# EAGLE schematic ATEMconsole (EAGLE 6.2)
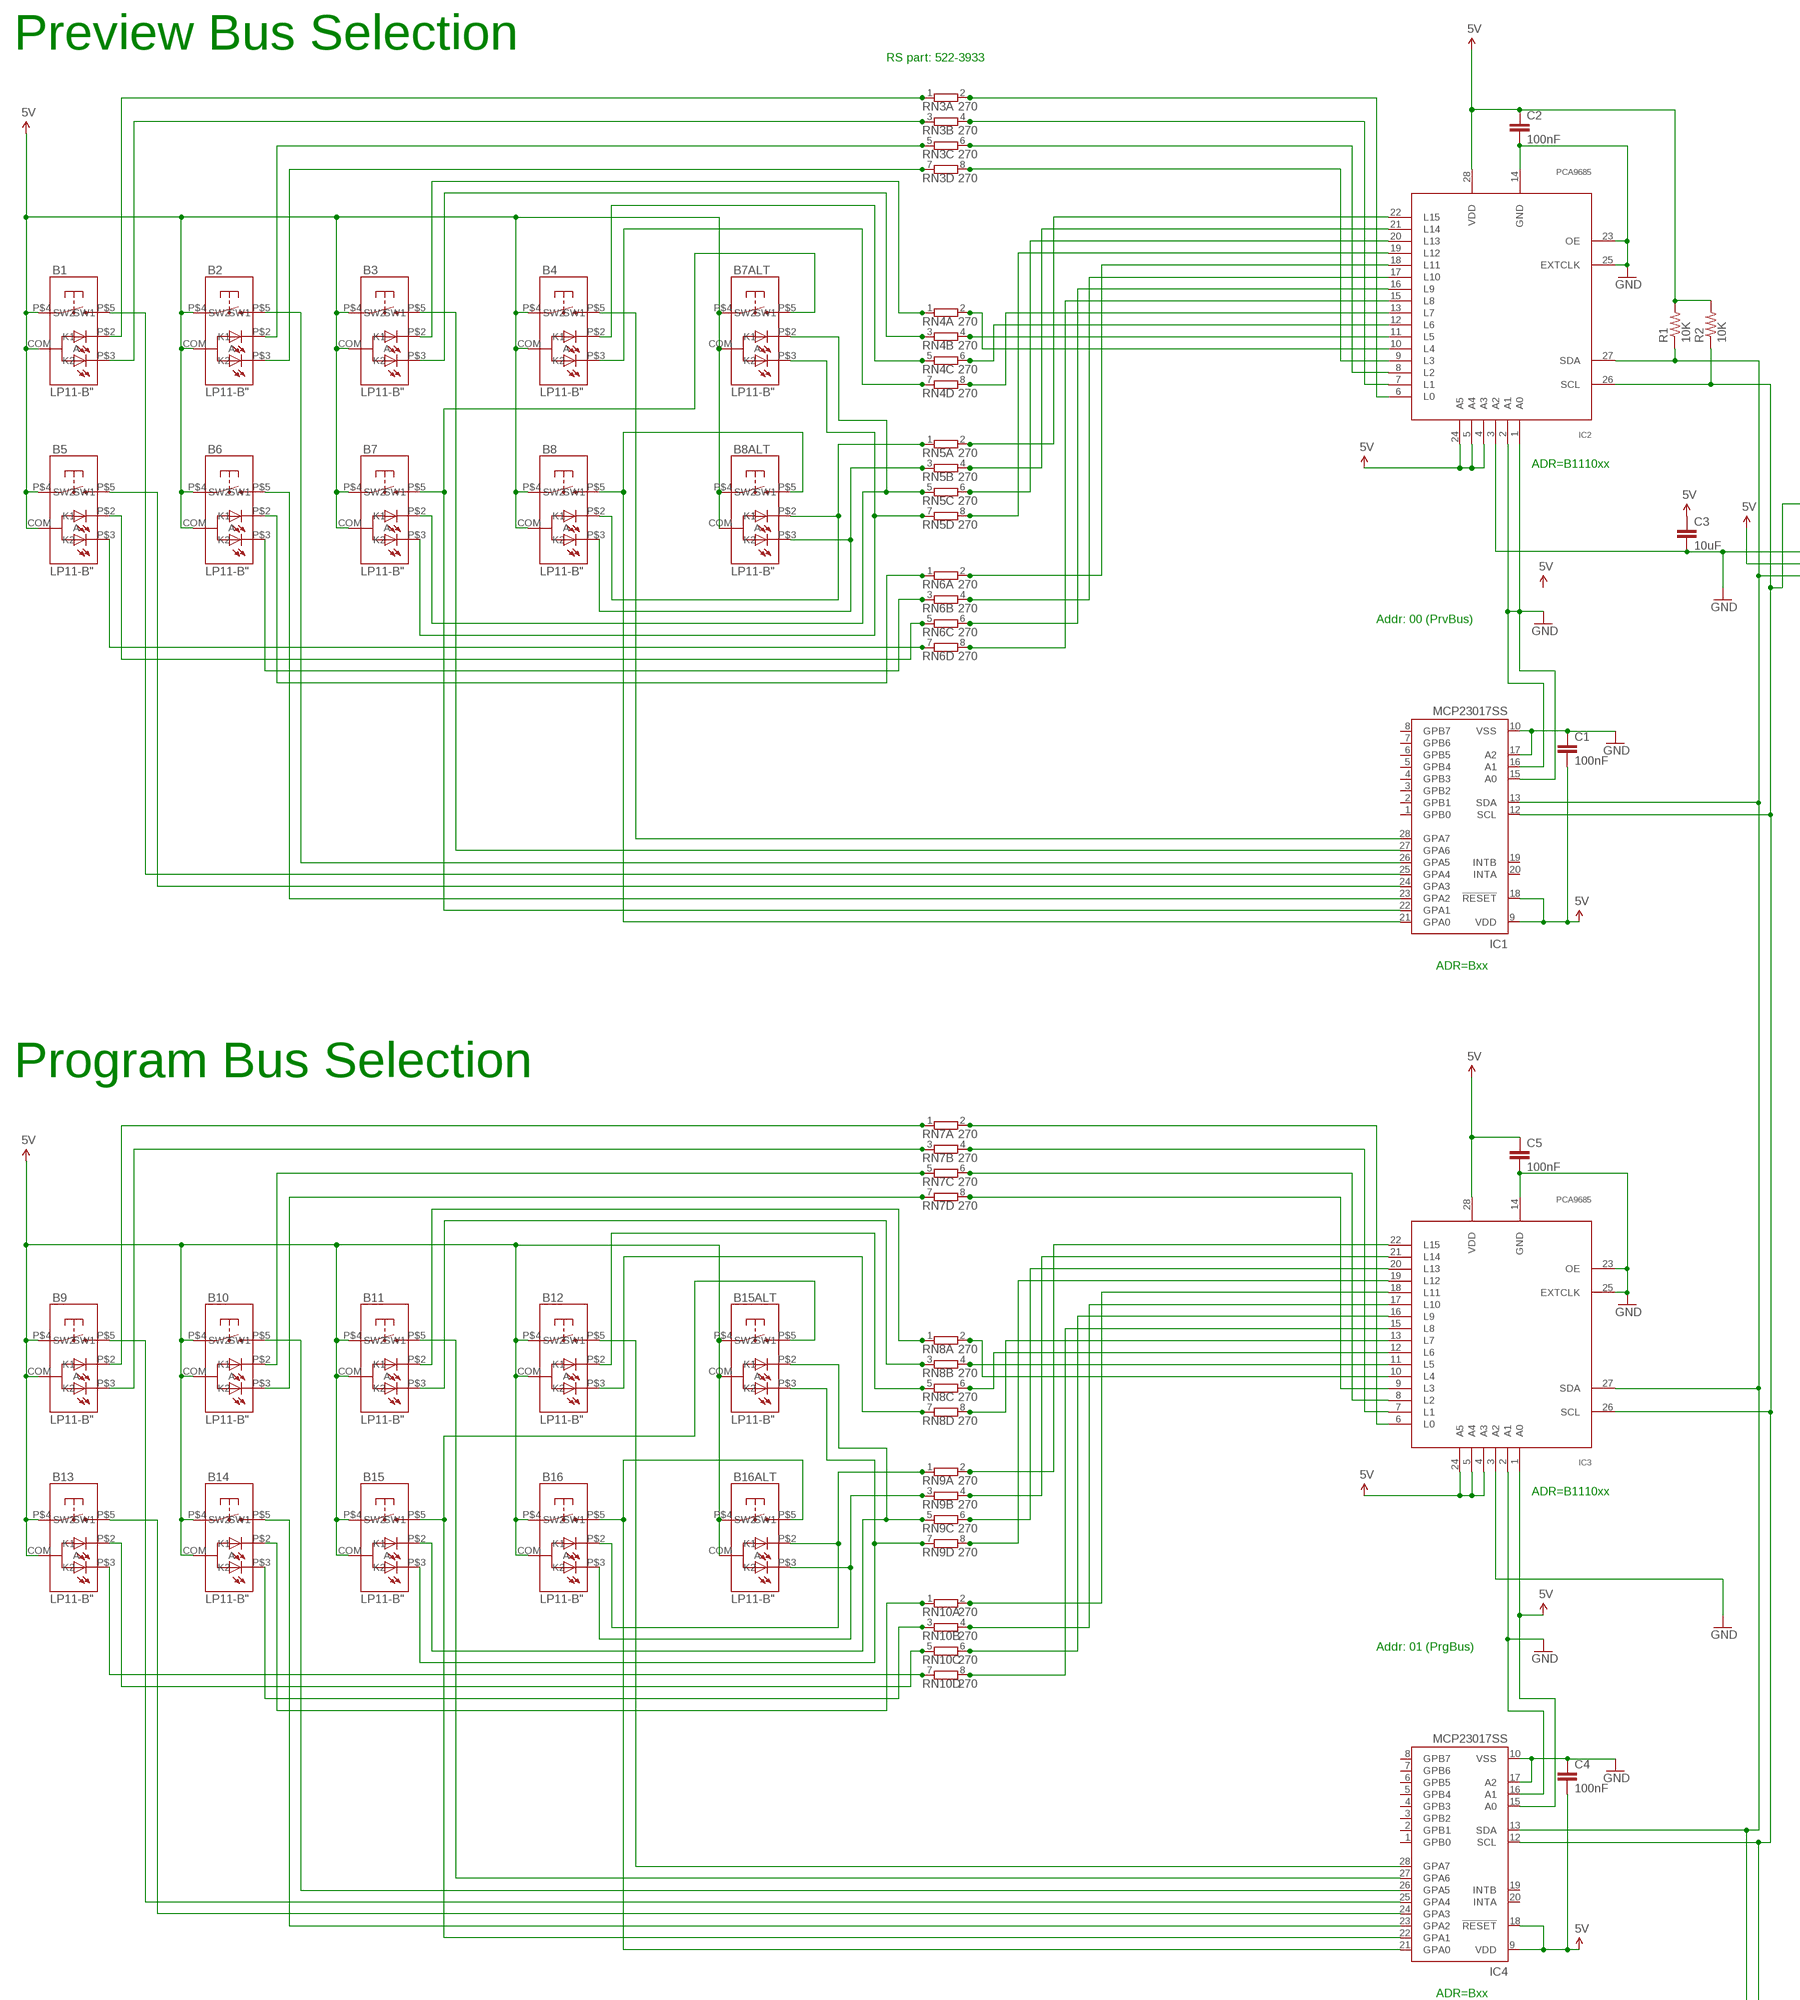
[diagram p0: schematic, sheet 1, part 1 of 3]
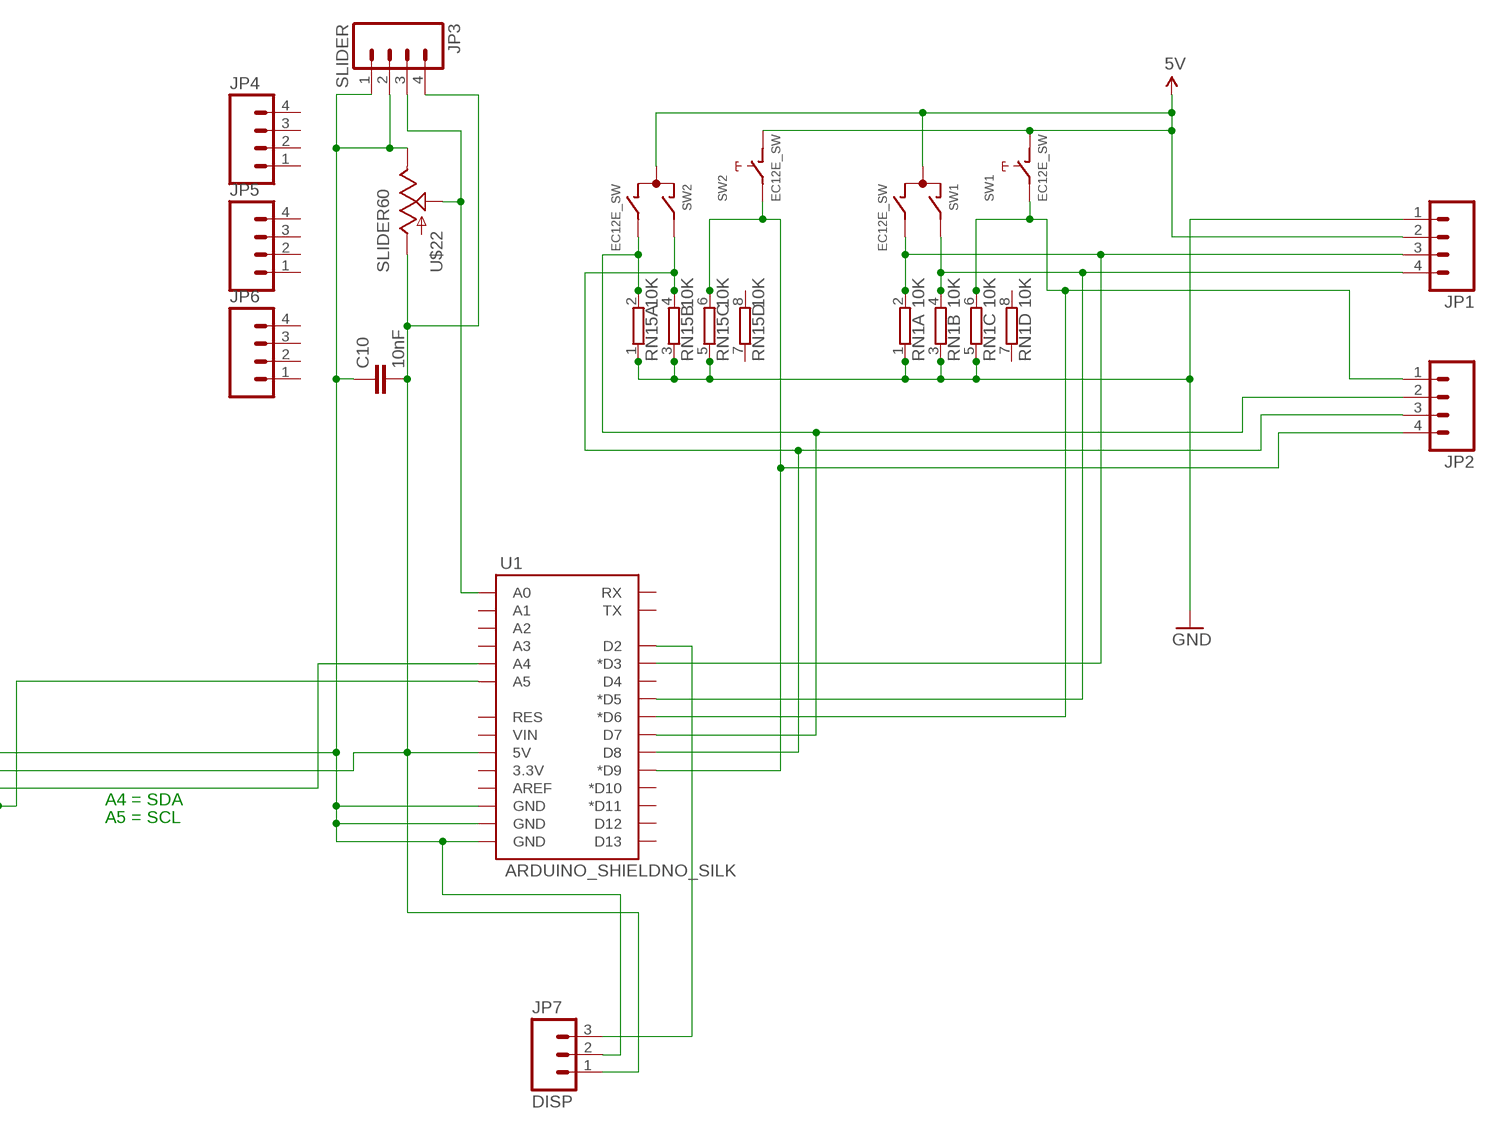
[diagram p1: schematic, sheet 1, part 2 of 3]
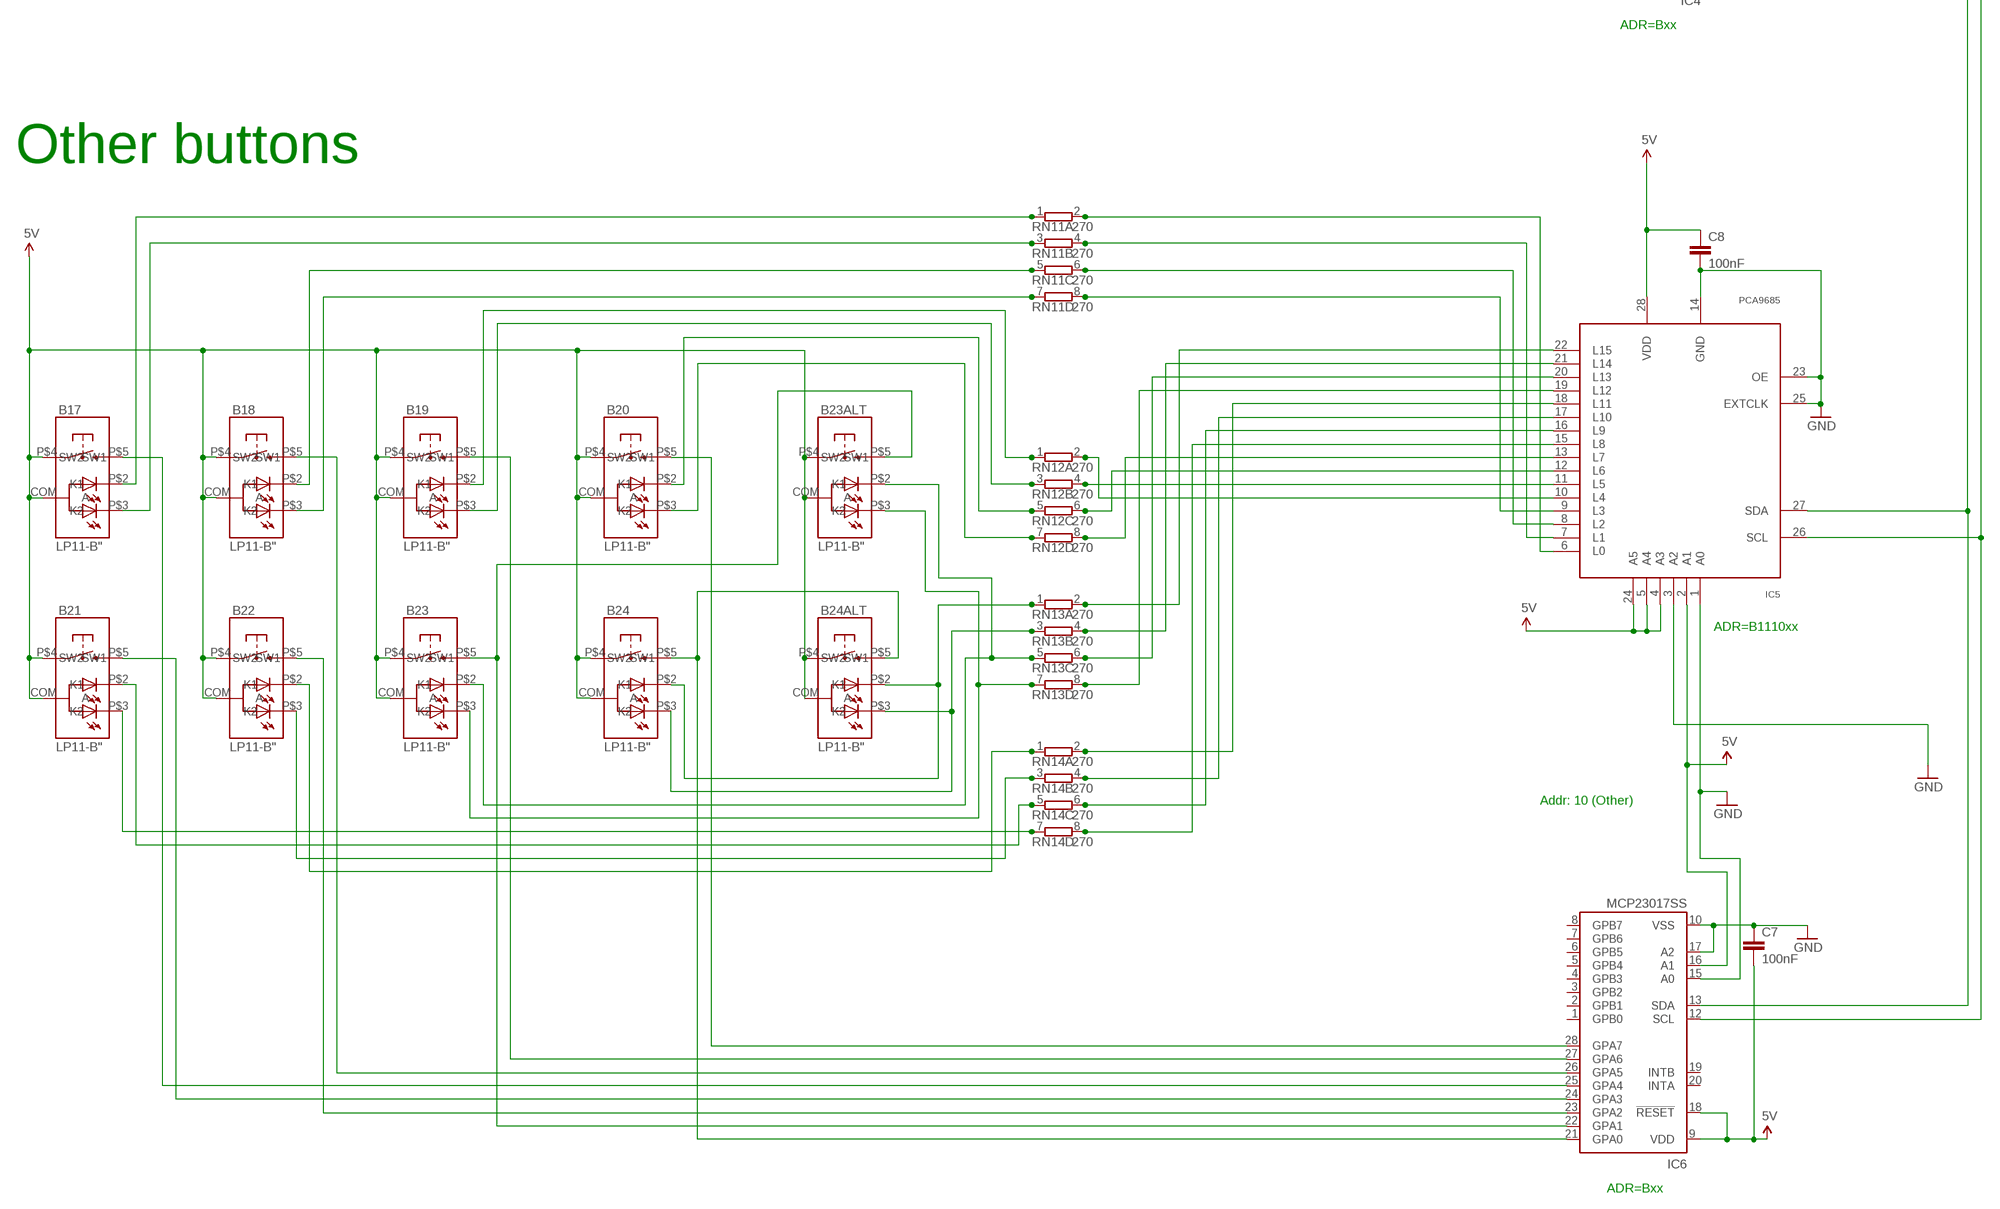
[diagram p2: schematic, sheet 1, part 3 of 3]

## Parts
B1  LP11-B"  [LP11]
B2  LP11-B"  [LP11]
B3  LP11-B"  [LP11]
B4  LP11-B"  [LP11]
B5  LP11-B"  [LP11]
B6  LP11-B"  [LP11]
B7  LP11-B"  [LP11]
B7ALT  LP11-B"  [LP11]
B8  LP11-B"  [LP11]
B8ALT  LP11-B"  [LP11]
B9  LP11-B"  [LP11]
B10  LP11-B"  [LP11]
B11  LP11-B"  [LP11]
B12  LP11-B"  [LP11]
B13  LP11-B"  [LP11]
B14  LP11-B"  [LP11]
B15  LP11-B"  [LP11]
B15ALT  LP11-B"  [LP11]
B16  LP11-B"  [LP11]
B16ALT  LP11-B"  [LP11]
B17  LP11-B"  [LP11]
B18  LP11-B"  [LP11]
B19  LP11-B"  [LP11]
B20  LP11-B"  [LP11]
B21  LP11-B"  [LP11]
B22  LP11-B"  [LP11]
B23  LP11-B"  [LP11]
B23ALT  LP11-B"  [LP11]
B24  LP11-B"  [LP11]
B24ALT  LP11-B"  [LP11]
C1  100nF  CAP_  [AXIAL-5MM]
C2  100nF  CAP_  [AXIAL-5MM]
C3  10uF  CAP_  [AXIAL-5MM]
C4  100nF  CAP_  [AXIAL-5MM]
C5  100nF  CAP_  [AXIAL-5MM]
C7  100nF  CAP_  [AXIAL-5MM]
C8  100nF  CAP_  [AXIAL-5MM]
C10  10nF  CAP_  [AXIAL-5MM]
IC1  MCP23017SS  [SSOP28]
IC2  PCA9685  [TSSOP28]
IC3  PCA9685  [TSSOP28]
IC4  MCP23017SS  [SSOP28]
IC5  PCA9685  [TSSOP28]
IC6  MCP23017SS  [SSOP28]
JP1  M04PTH  [1X04]
JP2  M04PTH  [1X04]
JP3  SLIDER  M04PTH  [1X04]
JP4  M04PTH  [1X04]
JP5  M04PTH  [1X04]
JP6  M04PTH  [1X04]
JP7  DISP  M03PTH  [1X03]
R1  10K  RESISTOR0603-RES  [0603-RES]
R2  10K  RESISTOR0603-RES  [0603-RES]
RN1  10K  E4R  [SIL8]
RN3  270  E4R  [SIL8]
RN4  270  E4R  [SIL8]
RN5  270  E4R  [SIL8]
RN6  270  E4R  [SIL8]
RN7  270  E4R  [SIL8]
RN8  270  E4R  [SIL8]
RN9  270  E4R  [SIL8]
RN10  270  E4R  [SIL8]
RN11  270  E4R  [SIL8]
RN12  270  E4R  [SIL8]
RN13  270  E4R  [SIL8]
RN14  270  E4R  [SIL8]
RN15  10K  E4R  [SIL8]
SW1  EC12E_SW  [ALPS_EC12E_SW]
SW2  EC12E_SW  [ALPS_EC12E_SW]
U1  ARDUINO_SHIELDNO_SILK  [DUEMILANOVE_VIAS]
U$22  SLIDER60  [SLIDER60]

## Nets
5V [Power]: B1.COM(A) B1.P$4(SW1) B2.COM(A) B2.P$4(SW1) B3.COM(A) B3.P$4(SW1) B4.COM(A) B4.P$4(SW1) B5.COM(A) B5.P$4(SW1) B6.COM(A) B6.P$4(SW1) B7.COM(A) B7.P$4(SW1) B7ALT.COM(A) B7ALT.P$4(SW1) B8.COM(A) B8.P$4(SW1) B8ALT.COM(A) B8ALT.P$4(SW1) B9.COM(A) B9.P$4(SW1) B10.COM(A) B10.P$4(SW1) B11.COM(A) B11.P$4(SW1) B12.COM(A) B12.P$4(SW1) B13.COM(A) B13.P$4(SW1) B14.COM(A) B14.P$4(SW1) B15.COM(A) B15.P$4(SW1) B15ALT.COM(A) B15ALT.P$4(SW1) B16.COM(A) B16.P$4(SW1) B16ALT.COM(A) B16ALT.P$4(SW1) B17.COM(A) B17.P$4(SW1) B18.COM(A) B18.P$4(SW1) B19.COM(A) B19.P$4(SW1) B20.COM(A) B20.P$4(SW1) B21.COM(A) B21.P$4(SW1) B22.COM(A) B22.P$4(SW1) B23.COM(A) B23.P$4(SW1) B23ALT.COM(A) B23ALT.P$4(SW1) B24.COM(A) B24.P$4(SW1) B24ALT.COM(A) B24ALT.P$4(SW1) C1.P$2 C2.P$1 C3.P$1 C4.P$2 C5.P$1 C7.P$2 C8.P$1 C10.P$2 IC1.9(VDD) IC1.18(!RESET) IC2.4(A3) IC2.5(A4) IC2.24(A5) IC2.28(VDD) IC3.1(A0) IC3.4(A3) IC3.5(A4) IC3.24(A5) IC3.28(VDD) IC4.9(VDD) IC4.15(A0) IC4.18(!RESET) IC5.2(A1) IC5.4(A3) IC5.5(A4) IC5.24(A5) IC5.28(VDD) IC6.9(VDD) IC6.16(A1) IC6.18(!RESET) JP1.2 JP3.4 JP7.1 R1.2 R2.2 SW1.C SW1.D SW2.C SW2.D U1.5V U$22.3(A)
GND [Power]: C1.P$1 C2.P$2 C3.P$2 C4.P$1 C5.P$2 C7.P$1 C8.P$2 C10.P$1 IC1.10(VSS) IC1.15(A0) IC1.16(A1) IC1.17(A2) IC2.1(A0) IC2.2(A1) IC2.3(A2) IC2.14(GND) IC2.23(OE) IC2.25(EXTCLK) IC3.2(A1) IC3.3(A2) IC3.14(GND) IC3.23(OE) IC3.25(EXTCLK) IC4.10(VSS) IC4.16(A1) IC4.17(A2) IC5.1(A0) IC5.3(A2) IC5.14(GND) IC5.23(OE) IC5.25(EXTCLK) IC6.10(VSS) IC6.15(A0) IC6.17(A2) JP1.1 JP3.1 JP3.2 JP7.2 RN1.1 RN1.3 RN1.5 RN15.1 RN15.3 RN15.5 U1.GND@0(GND) U1.GND@1(GND) U1.GND@2(GND) U$22.1(E)
JP1: JP2.2 RN15.2 SW2.B U1.D7
N$1: JP7.3 U1.D2
N$2: B7.P$3(K2) B7ALT.P$3(K2) RN5.7
N$4: B2.P$2(K1) RN3.5
N$5: B2.P$3(K2) RN3.7
N$7: B1.P$2(K1) RN3.1
N$8: B1.P$3(K2) RN3.3
N$9: IC2.6(L0) RN3.2
N$10: IC2.7(L1) RN3.4
N$11: IC2.8(L2) RN3.6
N$12: IC2.9(L3) RN3.8
N$13: IC2.10(L4) RN4.2
N$14: IC2.11(L5) RN4.4
N$15: IC2.12(L6) RN4.6
N$16: IC2.13(L7) RN4.8
N$17: B3.P$2(K1) RN4.1
N$18: B3.P$3(K2) RN4.3
N$19: B4.P$2(K1) RN4.5
N$20: B4.P$3(K2) RN4.7
N$21: IC2.19(L12) RN5.8
N$22: IC2.20(L13) RN5.6
N$23: IC2.21(L14) RN5.4
N$24: IC2.22(L15) RN5.2
N$25: IC2.15(L8) RN6.8
N$26: IC2.16(L9) RN6.6
N$27: IC2.17(L10) RN6.4
N$28: IC2.18(L11) RN6.2
N$29: B5.P$3(K2) RN6.7
N$30: B5.P$2(K1) RN6.5
N$31: B6.P$3(K2) RN6.3
N$32: B6.P$2(K1) RN6.1
N$34: B9.P$2(K1) RN7.1
N$35: B8.P$3(K2) B8ALT.P$3(K2) RN5.3
N$36: B8.P$2(K1) B8ALT.P$2(K1) RN5.1
N$37: B1.P$5(SW2) IC1.25(GPA4)
N$38: B5.P$5(SW2) IC1.24(GPA3)
N$39: B6.P$5(SW2) IC1.23(GPA2)
N$40: B2.P$5(SW2) IC1.26(GPA5)
N$41: B8.P$5(SW2) B8ALT.P$5(SW2) IC1.21(GPA0)
N$42: B7.P$5(SW2) B7ALT.P$5(SW2) IC1.22(GPA1)
N$43: B4.P$5(SW2) IC1.28(GPA7)
N$44: B3.P$5(SW2) IC1.27(GPA6)
N$45: B9.P$3(K2) RN7.3
N$46: B7.P$2(K1) B7ALT.P$2(K1) RN5.5
N$47: B10.P$2(K1) RN7.5
N$48: B10.P$3(K2) RN7.7
N$49: IC3.6(L0) RN7.2
N$50: IC3.7(L1) RN7.4
N$51: IC3.8(L2) RN7.6
N$52: IC3.9(L3) RN7.8
N$53: IC3.10(L4) RN8.2
N$54: IC3.11(L5) RN8.4
N$55: IC3.12(L6) RN8.6
N$56: IC3.13(L7) RN8.8
N$57: B11.P$2(K1) RN8.1
N$58: B11.P$3(K2) RN8.3
N$59: B12.P$2(K1) RN8.5
N$60: B12.P$3(K2) RN8.7
N$61: IC3.19(L12) RN9.8
N$62: IC3.20(L13) RN9.6
N$63: IC3.21(L14) RN9.4
N$64: IC3.22(L15) RN9.2
N$65: IC3.15(L8) RN10.8
N$66: IC3.16(L9) RN10.6
N$67: IC3.17(L10) RN10.4
N$68: IC3.18(L11) RN10.2
N$69: B13.P$3(K2) RN10.7
N$70: B13.P$2(K1) RN10.5
N$71: B14.P$3(K2) RN10.3
N$72: B14.P$2(K1) RN10.1
N$73: B16.P$3(K2) B16ALT.P$3(K2) RN9.3
N$74: B16.P$2(K1) B16ALT.P$2(K1) RN9.1
N$75: B9.P$5(SW2) IC4.25(GPA4)
N$76: B13.P$5(SW2) IC4.24(GPA3)
N$77: B14.P$5(SW2) IC4.23(GPA2)
N$78: B10.P$5(SW2) IC4.26(GPA5)
N$79: B16.P$5(SW2) B16ALT.P$5(SW2) IC4.21(GPA0)
N$80: B15.P$5(SW2) B15ALT.P$5(SW2) IC4.22(GPA1)
N$81: B12.P$5(SW2) IC4.28(GPA7)
N$82: B11.P$5(SW2) IC4.27(GPA6)
N$83: B15.P$2(K1) B15ALT.P$2(K1) RN9.5
N$84: B15.P$3(K2) B15ALT.P$3(K2) RN9.7
N$85: IC1.12(SCL) IC2.26(SCL) IC3.26(SCL) IC4.12(SCL) IC5.26(SCL) IC6.12(SCL) R2.1 U1.A5
N$86: IC1.13(SDA) IC2.27(SDA) IC3.27(SDA) IC4.13(SDA) IC5.27(SDA) IC6.13(SDA) R1.1 U1.A4
N$87: B17.P$2(K1) RN11.1
N$88: B17.P$3(K2) RN11.3
N$89: B18.P$2(K1) RN11.5
N$90: B18.P$3(K2) RN11.7
N$91: IC5.6(L0) RN11.2
N$92: IC5.7(L1) RN11.4
N$93: IC5.8(L2) RN11.6
N$94: IC5.9(L3) RN11.8
N$95: IC5.10(L4) RN12.2
N$96: IC5.11(L5) RN12.4
N$97: IC5.12(L6) RN12.6
N$98: IC5.13(L7) RN12.8
N$99: B19.P$2(K1) RN12.1
N$100: B19.P$3(K2) RN12.3
N$101: B20.P$2(K1) RN12.5
N$102: B20.P$3(K2) RN12.7
N$103: IC5.19(L12) RN13.8
N$104: IC5.20(L13) RN13.6
N$105: IC5.21(L14) RN13.4
N$106: IC5.22(L15) RN13.2
N$107: IC5.15(L8) RN14.8
N$108: IC5.16(L9) RN14.6
N$109: IC5.17(L10) RN14.4
N$110: IC5.18(L11) RN14.2
N$111: B21.P$3(K2) RN14.7
N$112: B21.P$2(K1) RN14.5
N$113: B22.P$3(K2) RN14.3
N$114: B22.P$2(K1) RN14.1
N$115: B24.P$3(K2) B24ALT.P$3(K2) RN13.3
N$116: B24.P$2(K1) B24ALT.P$2(K1) RN13.1
N$117: B17.P$5(SW2) IC6.25(GPA4)
N$118: B21.P$5(SW2) IC6.24(GPA3)
N$119: B22.P$5(SW2) IC6.23(GPA2)
N$120: B18.P$5(SW2) IC6.26(GPA5)
N$121: B24.P$5(SW2) B24ALT.P$5(SW2) IC6.21(GPA0)
N$122: B23.P$5(SW2) B23ALT.P$5(SW2) IC6.22(GPA1)
N$123: B20.P$5(SW2) IC6.28(GPA7)
N$124: B19.P$5(SW2) IC6.27(GPA6)
N$125: B23.P$2(K1) B23ALT.P$2(K1) RN13.5
N$126: B23.P$3(K2) B23ALT.P$3(K2) RN13.7
N$127: JP1.3 RN1.2 SW1.B U1.D3(*D3)
N$128: JP1.4 RN1.4 SW1.A U1.D5(*D5)
N$129: JP2.1 RN1.6 SW1.E U1.D6(*D6)
N$130: JP2.3 RN15.4 SW2.A U1.D8
N$131: JP2.4 RN15.6 SW2.E U1.D9(*D9)
N$132: JP3.3 U1.A0 U$22.2A(S)
Unconnected: IC1.1(GPB0) IC1.2(GPB1) IC1.3(GPB2) IC1.4(GPB3) IC1.5(GPB4) IC1.6(GPB5) IC1.7(GPB6) IC1.8(GPB7) IC1.19(INTB) IC1.20(INTA) IC4.1(GPB0) IC4.2(GPB1) IC4.3(GPB2) IC4.4(GPB3) IC4.5(GPB4) IC4.6(GPB5) IC4.7(GPB6) IC4.8(GPB7) IC4.19(INTB) IC4.20(INTA) IC6.1(GPB0) IC6.2(GPB1) IC6.3(GPB2) IC6.4(GPB3) IC6.5(GPB4) IC6.6(GPB5) IC6.7(GPB6) IC6.8(GPB7) IC6.19(INTB) IC6.20(INTA) JP4.1 JP4.2 JP4.3 JP4.4 JP5.1 JP5.2 JP5.3 JP5.4 JP6.1 JP6.2 JP6.3 JP6.4 RN1.7 RN1.8 RN15.7 RN15.8 SW1.GND1(G) SW1.GND2(G) SW2.GND1(G) SW2.GND2(G) U1.3.3V U1.A1 U1.A2 U1.A3 U1.AREF U1.D4 U1.D10(*D10) U1.D11(*D11) U1.D12 U1.D13 U1.RES U1.RX U1.TX U1.VIN

## Notes on the sheet
- Preview Bus Selection
- RS part: 522-3933
- ADR=B1110xx
- A4 = SDA
- A5 = SCL
- Addr: 00 (PrvBus)
- ADR=Bxx
- Program Bus Selection
- ADR=B1110xx
- Addr: 01 (PrgBus)
- ADR=Bxx
- Other buttons
- ADR=B1110xx
- Addr: 10 (Other)
- ADR=Bxx

## Library data of the parts
B1-B7 B7ALT B8 B8ALT B9-B15 B15ALT B16 B16ALT B17-B23 B23ALT B24 B24ALT = SKAARHOJ:LP11-B
C1-C5 C7 C8 C10 = SparkFun:CAP: Capacitor Standard 0603 ceramic capacitor, and 0.1" leaded capacitor.
IC1 IC4 IC6 = microchip:MCP23017: http://ww1.microchip.com/downloads/en/DeviceDoc/21952a.pdf Source: http://ww1.microchip.com/downloads/en/DeviceDoc/21952a.pdf; MF: MICROCHIP; MPN: MCP23017-E/SS; OC_FARNELL: 1467674; OC_NEWARK: 31K2960
IC2 IC3 IC5 = wsmith:PCA9685
JP1-JP6 = SparkFun:M04: Header 4 Standard 4-pin 0.1" header. Use with straight break away headers (SKU : PRT-00116), right angle break away headers (PRT-00553), swiss pins (PRT-00743), machine pins (PRT-00117), and female headers (PRT-00115). Molex polarized connector foot print use with SKU : PRT-08231 with associated crimp pins and housings. 1MM SMD Version SKU: PRT-10208
JP7 = SparkFun:M03: Header 3 Standard 3-pin 0.1" header. Use with straight break away headers (SKU : PRT-00116), right angle break away headers (PRT-00553), swiss pins (PRT-00743), machine pins (PRT-00117), and female headers (PRT-00115). Molex polarized connector foot print use with SKU : PRT-08232 with associated crimp pins and housings.
R1 R2 = SparkFun:RESISTOR: Resistor Basic schematic elements and footprints for 0603, 1206, and PTH resistors.
RN1 RN3-RN15 = resistor-sil:E4R: SIL RESISTOR; OC_FARNELL: unknown; OC_NEWARK: unknown
SW1 SW2 = switch-alps:EC12E_SW: ALPS rotary Encoder EC12E series with switch; MPN: EC12E2424407; OC_FARNELL: 1520813; OC_NEWARK: 74M1068
U1 = SparkFun:ARDUINO_SHIELD
U$22 = SKAARHOJ:SLIDER

## Net classes
0 default: width 0.203 mm, clearance 0.152 mm
1 Power: width 0.254 mm, clearance 0.203 mm